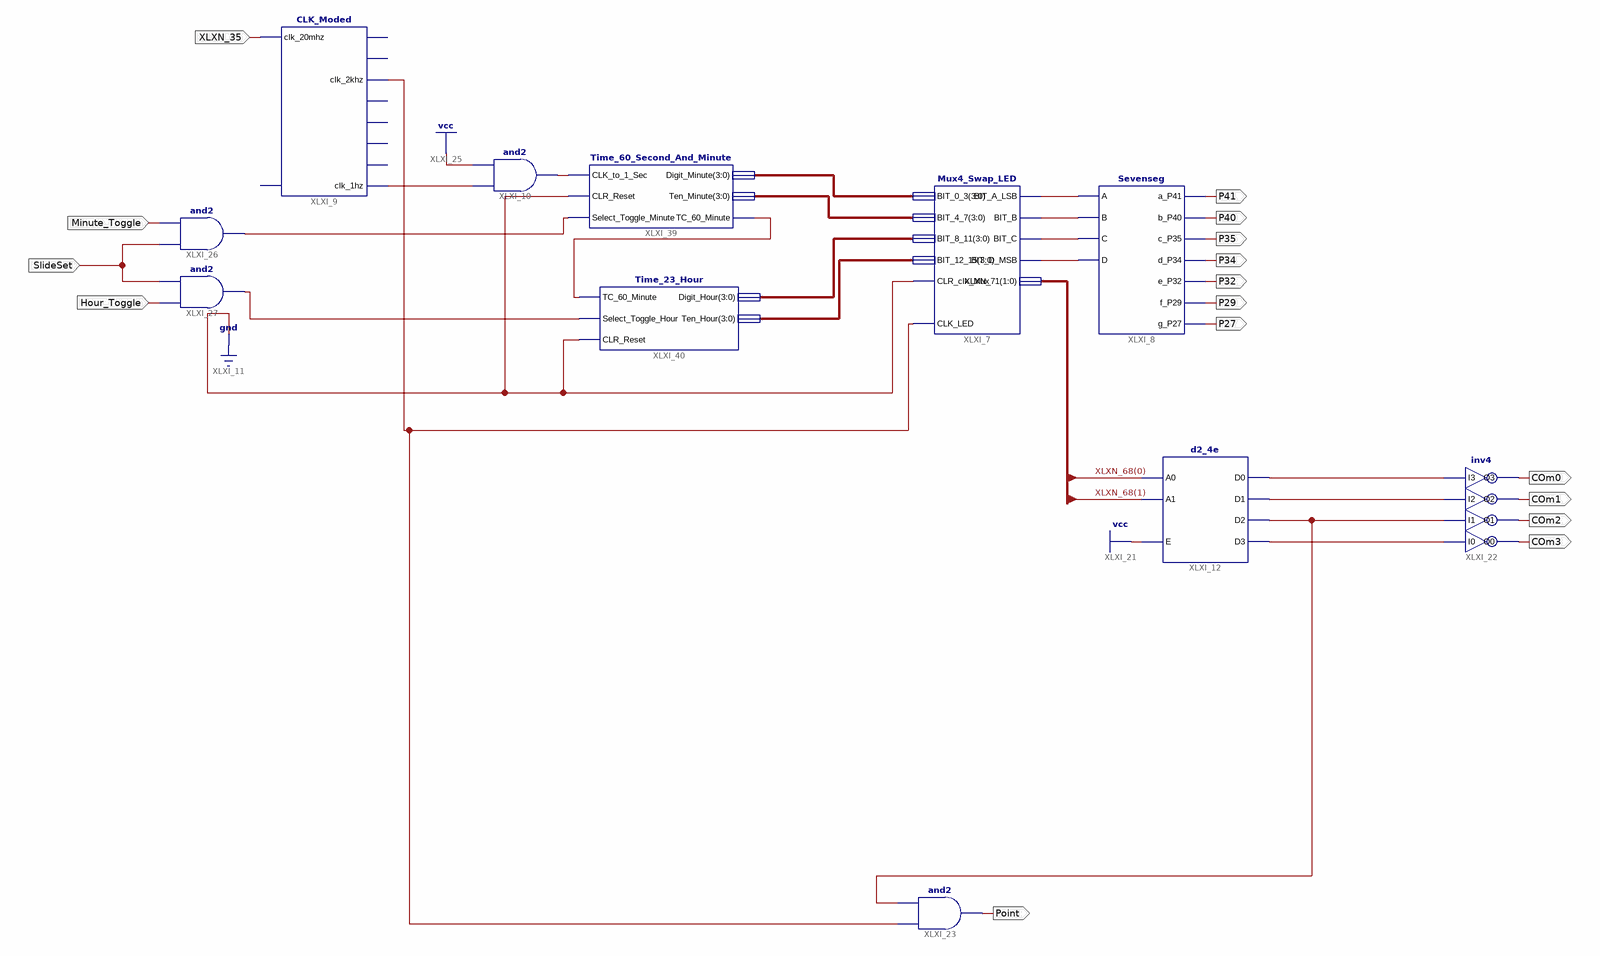
[diagram p0: schematic sheet 1]
// Xilinx ISE schematic NaringKa.sch (spartan6) as structural Verilog: 11 symbols, 16 ports
module NaringKa (
  input  XLXN_35,
  input  SlideSet,
  input  Minute_Toggle,
  input  Hour_Toggle,
  output P41,
  output P40,
  output P35,
  output P34,
  output P32,
  output P29,
  output P27,
  output COm0,
  output COm1,
  output COm2,
  output COm3,
  output Point
);

  wire XLXN_21, XLXN_22, XLXN_23, XLXN_24, XLXN_32, XLXN_33, XLXN_75, XLXN_76, XLXN_78, XLXN_83, XLXN_84,
       XLXN_87, XLXN_98, XLXN_116;
  wire [1:0] XLXN_68;
  wire [3:0] XLXN_117, XLXN_118, XLXN_121, XLXN_122;

  Mux4_Swap_LED XLXI_7 (
    .BIT_0_3(XLXN_117), .BIT_4_7(XLXN_118), .BIT_8_11(XLXN_121), .BIT_12_15(XLXN_122), .CLR_clk_Mux(1'b0),
    .BIT_A_LSB(XLXN_21), .BIT_D_MSB(XLXN_24), .BIT_C(XLXN_23), .BIT_B(XLXN_22), .XLXN_71(XLXN_68),
    .CLK_LED(XLXN_83));
  Sevenseg XLXI_8 (
    .A(XLXN_21), .a_P41(P41), .B(XLXN_22), .b_P40(P40), .C(XLXN_23), .c_P35(P35), .D(XLXN_24), .d_P34(P34),
    .e_P32(P32), .f_P29(P29), .g_P27(P27));
  and XLXI_10 (XLXN_32, XLXN_33, 1'b1);
  CLK_Moded XLXI_9 (
    .clk_20mhz(XLXN_35), .clk_2khz(XLXN_83), .clk_1hz(XLXN_33));  // open: Reset_CLK, clk_2mhz, clk_200khz, clk_200hz, clk_2hz, clk_20khz, clk_20hz
  d2_4e XLXI_12 (.A0(XLXN_68[0]), .A1(XLXN_68[1]), .E(1'b1), .D0(XLXN_75), .D1(XLXN_76), .D2(XLXN_84), .D3(XLXN_78));
  inv4 XLXI_22 (.I0(XLXN_78), .I1(XLXN_84), .I2(XLXN_76), .I3(XLXN_75), .O0(COm3), .O1(COm2), .O2(COm1), .O3(COm0));
  and XLXI_23 (Point, XLXN_83, XLXN_84);
  and XLXI_26 (XLXN_87, SlideSet, Minute_Toggle);
  and XLXI_27 (XLXN_98, Hour_Toggle, SlideSet);
  Time_60_Second_And_Minute XLXI_39 (
    .CLK_to_1_Sec(XLXN_32), .CLR_Reset(1'b0), .Digit_Minute(XLXN_117), .Select_Toggle_Minute(XLXN_87),
    .TC_60_Minute(XLXN_116), .Ten_Minute(XLXN_118));
  Time_23_Hour XLXI_40 (
    .CLR_Reset(1'b0), .Digit_Hour(XLXN_121), .Select_Toggle_Hour(XLXN_98), .TC_60_Minute(XLXN_116),
    .Ten_Hour(XLXN_122));
endmodule
